# EAGLE design ContinuityTester (EAGLE 7.6.0)
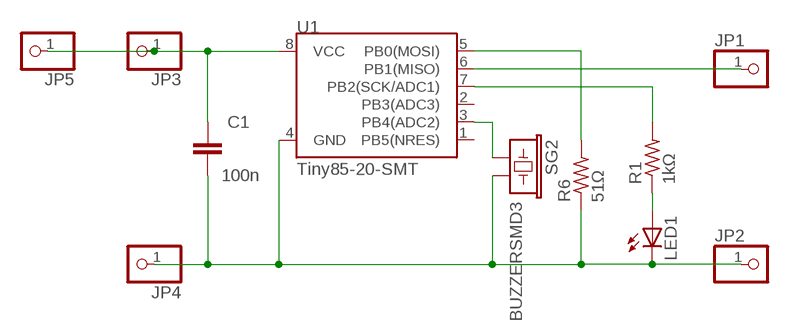
[diagram p0: schematic, sheet 1]

## Parts
C1  100n  CAP0603-CAP  [0603-CAP]
JP1  PINHD-1X1CB  [1X01-CLEANBIG]
JP2  PINHD-1X1CB  [1X01-CLEANBIG]
JP3  PINHD-1X1CB  [1X01-CLEANBIG]
JP4  PINHD-1X1CB  [1X01-CLEANBIG]
JP5  PINHD-1X1CB  [1X01-CLEANBIG]
LED1  LEDCHIPLED_0805  [CHIPLED_0805]
R1  1kΩ  R-US_R0805  [R0805]
R6  51Ω  R-US_R0805  [R0805]
SG2  BUZZERSMD3  [BUZZER-CMT1102]
U1  Tiny85-20-SMT  ATTINY45TINY85-20-SMT  [SO08-EIAJ]

## Nets
N$1: R6.2 U1.5(PB0(MOSI))
N$2: C1.2 JP2.1 JP4.1 LED1.C R6.1 SG2.2 U1.4(GND)
N$3: SG2.1 U1.3(PB4(ADC2))
N$4: R1.2 U1.7(PB2(SCK/ADC1))
N$5: LED1.A R1.1
N$6: JP1.1 U1.6(PB1(MISO))
N$7: C1.1 JP3.1 JP5.1 U1.8(VCC)
Unconnected: U1.1(PB5(NRES)) U1.2(PB3(ADC3))

## Library data of the parts
C1 = SparkFun-Capacitors:CAP: Capacitor Standard 0603 ceramic capacitor, and 0.1" leaded capacitor.
JP1-JP5 = adafruit:PINHD-1X1: Pin header 1x1 for 0.1" spacing With round pins
LED1 = adafruit:LED: LED OSRAM: - CHIPLED LG R971, LG N971, LY N971, LG Q971, LY Q971, LO R971, LY R971 LH N974, LH R974 LS Q976, LO Q976, LY Q976 LO Q996 - Hyper CHIPLED LW Q18S LB Q993, LB Q99A, LB R99A - SideLED LS A670, LO A670, LY A670, LG A670, LP A670 LB A673, LV A673, LT A673, LW A673 LH A674 LY A675 LS A676, LA A676, LO A676, LY A676, LW A676 LS A679, LY A679, LG A679 - Hyper Micro SIDELED® LS Y876, LA Y876, LO Y876, LY Y876 LT Y87S - SmartLED LW L88C, LW L88S LB L89C, LB L89S, LG L890 LS L89K, LO L89K, LY L89K LS L896, LA L896, LO L896, LY L896 - TOPLED LS T670, LO T670, LY T670, LG T670, LP T670 LSG T670, LSP T670, LSY T670, LOP T670, LYG T670 LG T671, LOG T671, LSG T671 LB T673, LV T673, LT T673, LW T673 LH T674 LS T676, LA T676, LO T676, LY T676, LB T676, LH T676, LSB T676, LW T676 LB T67C, LV T67C, LT T67C, LS T67K, LO T67K, LY T67K, LW E67C LS E67B, LA E67B, LO E67B, LY E67B, LB E67C, LV E67C, LT E67C LW T67C LS T679, LY T679, LG T679 LS T770, LO T770, LY T770, LG T770, LP T770 LB T773, LV T773, LT T773, LW T773 LH T774 LS E675, LA E675, LY E675, LS T675 LS T776, LA T776, LO T776, LY T776, LB T776 LHGB T686 LT T68C, LB T68C - Hyper Mini TOPLED® LB M676 - Mini TOPLED Santana® LG M470 LS M47K, LO M47K, LY M47K Source: http://www.osram.convergy.de/
R1 R6 = adafruit:R-US_: RESISTOR, American symbol
SG2 = SparkFun-Electromechanical:BUZZER: Buzzer 12mm Spark Fun Electronics SKU : Comp-Buzzer
U1 = SparkFun-DigitalIC:ATTINY45: Atmel 8-pin 2/4/8kB flash uC; PROD_ID: IC-09092

## Board
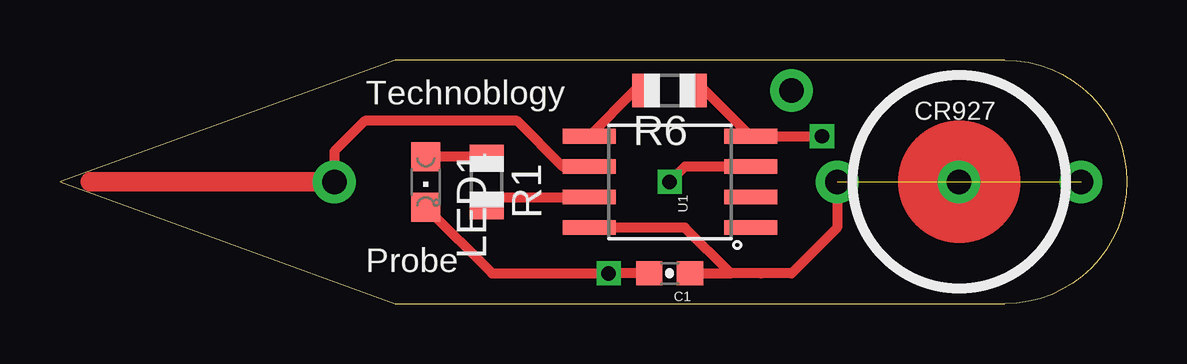
[diagram p1: board, top side]
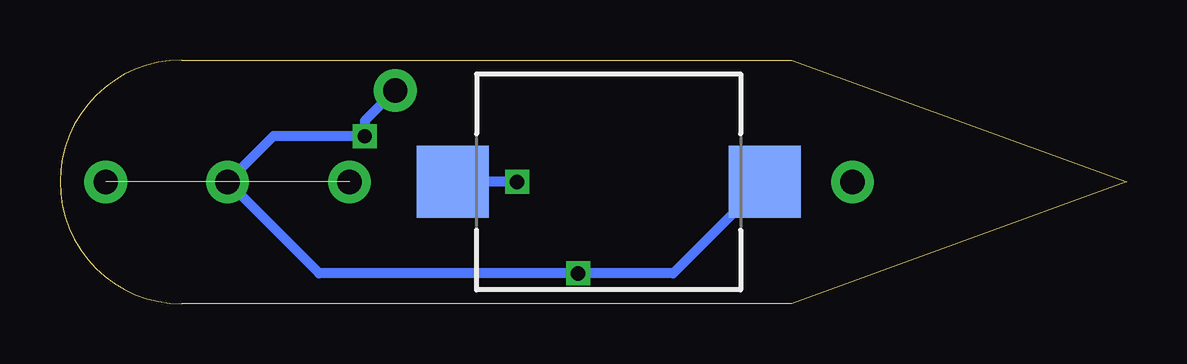
[diagram p2: board, bottom side, seen from below]

Size 44.45 x 10.16 mm. Coordinates in mm from the lower left corner, seen from the top.
Outline: 13.97,0 39.37,0 arc180 39.37,10.16 13.97,10.16 0,5.08 13.97,0
Copper layers (1*16): Top 0.035mm / dielectric 1.5mm / Bottom 0.035mm
Design rules "default": minimum track width 10mil, minimum drill 24mil, track to track 8mil, track to pad 8mil, pad to pad 8mil, via to via 8mil, smd to smd 8mil, copper to edge 40mil, drill to drill 8mil, minimum pad ring 10mil, minimum via ring 8mil, stop-mask expansion 4mil, vias tented up to drill 0mil, thermal gap 10mil

### Footprints (pad centres in the part's own frame; a part is rotated, then mirrored left to right if it is on the bottom)
0603-CAP = smd 1.1 x 1: 1 -0.85,0; 2 0.85,0
1X01-CLEANBIG = drill 1.016 pad 1.778: 1 0,0
CHIPLED_0805 = smd 1.2 x 1.2: A 0,-1.05; C 0,1.05
R0805 = smd 1.1 x 1.4: 1 -1,0; 2 1,0
BUZZER-CMT1102 = smd 3 x 3: 1 -6.5,0; 2 6.5,0
SO08-EIAJ = smd 0.61 x 2.21: 1 -1.905,-3.378; 2 -0.635,-3.378; 3 0.635,-3.378; 4 1.905,-3.378; 5 1.905,3.353; 6 0.635,3.353; 7 -0.635,3.353; 8 -1.905,3.353

### Placement (x,y rotation side)
C1  25.4,1.27 180 top
JP1  11.43,5.08 0 top
JP2  30.48,8.89 0 top
JP3  42.55,5.08 0 top
JP4  37.47,5.08 0 top
JP5  32.38,5.08 0 top
LED1  15.24,5.08 180 top
R1  17.78,5.08 270 top
R6  25.4,8.89 180 top
SG2  21.59,5.08 0 bottom
U1  25.4,5.08 90 top

### Tracks (layer width: path | path; a pad name or v marks a point on that pad's centre or on a via)
N$1
  Top 0.406: R6.2 23.95,8.89 U1.5
N$2  (via drill 0.6)
  Top 0.406: v31.75,6.99 U1.4 26.87,8.89 R6.1 | C1.2 v22.86,1.27 18,1.27 LED1.C
  Bottom 0.406: SG2.2 18.9,1.27 v22.86,1.27 33.66,1.27 JP4.1 35.56,6.99 v31.75,6.99 31.75,7.62 JP2.1
N$3  (via drill 0.6)
  Top 0.406: U1.3 26.04,5.71 v25.4,5.08
  Bottom 0.406: v25.4,5.08 SG2.1
N$4
  Top 0.406: R1.2 18.14,4.45 U1.7
N$5
  Top 0.406: R1.1 17.73,6.13 LED1.A
N$6
  Top 0.406: U1.6 20.95,5.71 19.05,7.62 12.7,7.62 11.43,6.35 JP1.1
  Top 0.813: JP1.1 1.27,5.08 JP1.1
N$7  (1 unrouted)
  Top 0.406: JP5.1 32.38,3.17 30.48,1.27 29.21,1.27 27.94,1.27 | 27.94,1.27 26.04,3.17 U1.8 | C1.1 27.94,1.27
(copper drawn outside any net)
  shapes: Top circle x1

### Text on the board
tPlace: Technoblogy | CR927 | Probe